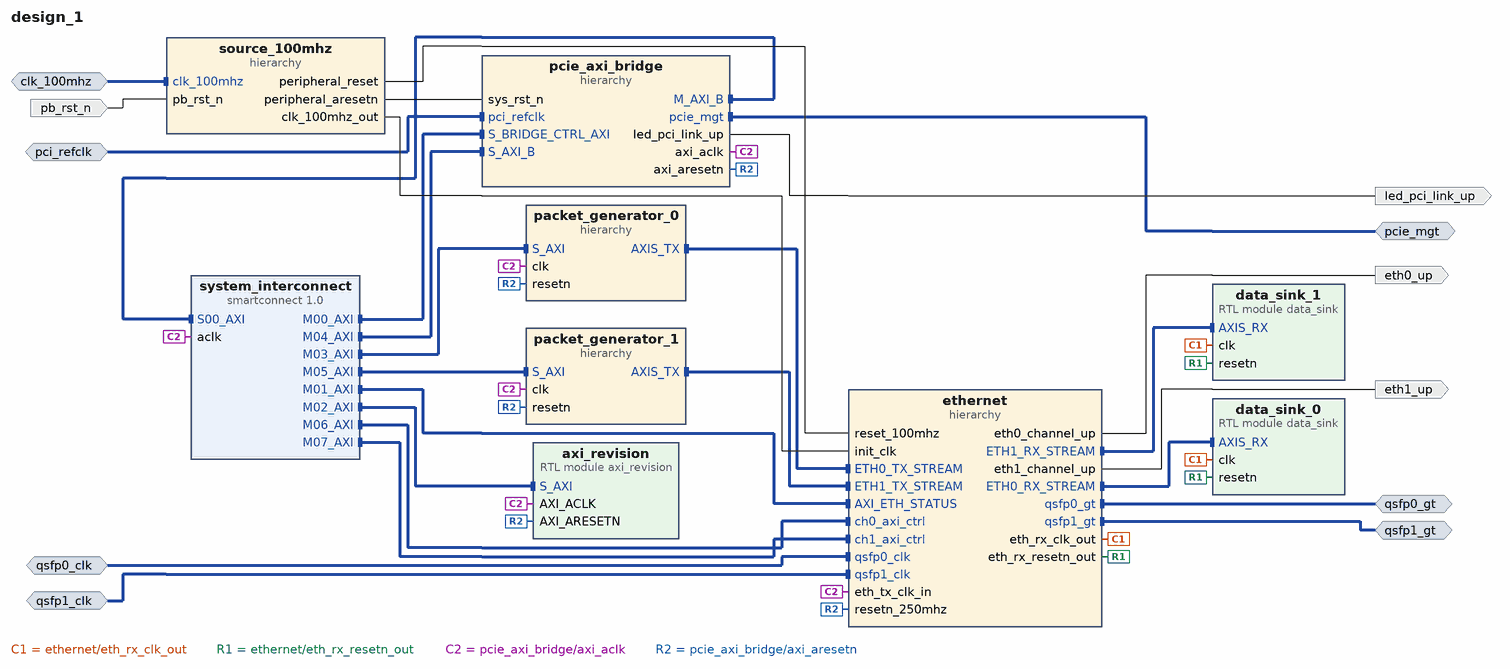
[diagram p0: block diagram of the top level]
# Vivado block design design_1, xczu19eg-ffvc1760-2-i, Vivado 2021.1
create_bd_design design_1

create_bd_intf_port -mode Slave -vlnv xilinx.com:interface:diff_clock_rtl:1.0 clk_100mhz
create_bd_intf_port -mode Slave -vlnv xilinx.com:interface:diff_clock_rtl:1.0 pci_refclk
create_bd_intf_port -mode Master -vlnv xilinx.com:interface:pcie_7x_mgt_rtl:1.0 pcie_mgt
create_bd_intf_port -mode Slave -vlnv xilinx.com:interface:diff_clock_rtl:1.0 qsfp0_clk
set_property -dict {CONFIG.FREQ_HZ 322265625} [get_bd_intf_ports qsfp0_clk]
create_bd_intf_port -mode Slave -vlnv xilinx.com:interface:diff_clock_rtl:1.0 qsfp1_clk
set_property -dict {CONFIG.FREQ_HZ 322265625} [get_bd_intf_ports qsfp1_clk]
create_bd_intf_port -mode Master -vlnv xilinx.com:interface:gt_rtl:1.0 qsfp0_gt
create_bd_intf_port -mode Master -vlnv xilinx.com:interface:gt_rtl:1.0 qsfp1_gt
create_bd_port -dir I -type rst pb_rst_n
create_bd_port -dir O led_pci_link_up
create_bd_port -dir O eth0_up
create_bd_port -dir O eth1_up

create_bd_cell -type hier pcie_axi_bridge
create_bd_cell -type hier ethernet
create_bd_cell -type ip -vlnv xilinx.com:ip:smartconnect:1.0 system_interconnect
set_property -dict [list \
  CONFIG.ADVANCED_PROPERTIES { __view__ { functional { S01_Entry { LIM_R_LEN 64 LIM_W_LEN 64 } S02_Entry { LIM_R_LEN 64 LIM_W_LEN 64 } } }} \
  CONFIG.HAS_ARESETN 0 \
  CONFIG.NUM_CLKS 1 \
  CONFIG.NUM_MI 8 \
  CONFIG.NUM_SI 3 \
] [get_bd_cells system_interconnect]
create_bd_cell -type hier source_100mhz
create_bd_cell -type module -reference axi_revision axi_revision
create_bd_cell -type module -reference data_sink data_sink_0
create_bd_cell -type module -reference data_sink data_sink_1
create_bd_cell -type hier packet_generator_0
create_bd_cell -type hier packet_generator_1

# ---- hierarchy /pcie_axi_bridge ----
current_bd_instance /pcie_axi_bridge
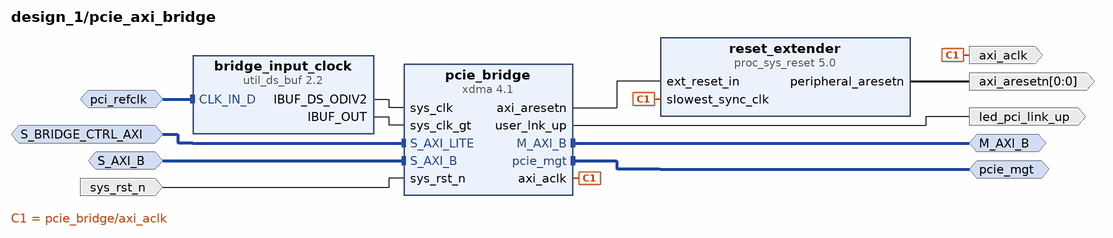
[diagram p1: block diagram inside /pcie_axi_bridge]
create_bd_intf_pin -mode Slave -vlnv xilinx.com:interface:aximm_rtl:1.0 S_BRIDGE_CTRL_AXI
create_bd_intf_pin -mode Slave -vlnv xilinx.com:interface:aximm_rtl:1.0 S_AXI_B
create_bd_intf_pin -mode Master -vlnv xilinx.com:interface:pcie_7x_mgt_rtl:1.0 pcie_mgt
create_bd_intf_pin -mode Master -vlnv xilinx.com:interface:aximm_rtl:1.0 M_AXI_B
create_bd_intf_pin -mode Slave -vlnv xilinx.com:interface:diff_clock_rtl:1.0 pci_refclk
create_bd_pin -dir O -from 0 -to 0 -type rst axi_aresetn
create_bd_pin -dir O -type clk axi_aclk
create_bd_pin -dir O led_pci_link_up
create_bd_pin -dir I -type rst sys_rst_n

create_bd_cell -type ip -vlnv xilinx.com:ip:xdma:4.1 pcie_bridge
set_property -dict [list \
  CONFIG.PF0_DEVICE_ID_mqdma 903F \
  CONFIG.PF0_SRIOV_VF_DEVICE_ID A03F \
  CONFIG.PF2_DEVICE_ID_mqdma 923F \
  CONFIG.PF3_DEVICE_ID_mqdma 933F \
  CONFIG.axi_addr_width 64 \
  CONFIG.axi_data_width 512_bit \
  CONFIG.axibar2pciebar_0 0x0 \
  CONFIG.axibar_num 1 \
  CONFIG.axilite_master_en true \
  CONFIG.axilite_master_size 8 \
  CONFIG.axisten_freq 250 \
  CONFIG.bridge_burst true \
  CONFIG.c_s_axi_supports_narrow_burst false \
  CONFIG.cfg_mgmt_if false \
  CONFIG.enable_jtag_dbg true \
  CONFIG.functional_mode AXI_Bridge \
  CONFIG.mode_selection Advanced \
  CONFIG.pcie_blk_locn X1Y0 \
  CONFIG.pcie_extended_tag false \
  CONFIG.pciebar2axibar_0 0x00000000 \
  CONFIG.pciebar2axibar_1 0x800000000 \
  CONFIG.pciebar2axibar_axil_master 0A0000000 \
  CONFIG.pf0_Use_Class_Code_Lookup_Assistant false \
  CONFIG.pf0_bar0_64bit false \
  CONFIG.pf0_bar0_scale Megabytes \
  CONFIG.pf0_bar0_size 1 \
  CONFIG.pf0_bar1_enabled true \
  CONFIG.pf0_bar1_scale Megabytes \
  CONFIG.pf0_bar1_size 1 \
  CONFIG.pf0_bar2_enabled false \
  CONFIG.pf0_base_class_menu Simple_communication_controllers \
  CONFIG.pf0_class_code_base 07 \
  CONFIG.pf0_class_code_interface 01 \
  CONFIG.pf0_class_code_sub 00 \
  CONFIG.pf0_device_id 903F \
  CONFIG.pf0_interrupt_pin INTA \
  CONFIG.pf0_msi_enabled false \
  CONFIG.pf0_sub_class_interface_menu 16450_compatible_serial_controller \
  CONFIG.pf0_subsystem_id 0007 \
  CONFIG.pl_link_cap_max_link_speed 8.0_GT/s \
  CONFIG.pl_link_cap_max_link_width X16 \
  CONFIG.plltype QPLL1 \
  CONFIG.xdma_num_usr_irq 1 \
  CONFIG.xdma_sts_ports false \
  CONFIG.xdma_wnum_rids 32 \
] [get_bd_cells pcie_bridge]
create_bd_cell -type ip -vlnv xilinx.com:ip:util_ds_buf:2.2 bridge_input_clock
set_property -dict {CONFIG.C_BUF_TYPE IBUFDSGTE} [get_bd_cells bridge_input_clock]
create_bd_cell -type ip -vlnv xilinx.com:ip:proc_sys_reset:5.0 reset_extender

# ---- hierarchy /ethernet ----
current_bd_instance /ethernet
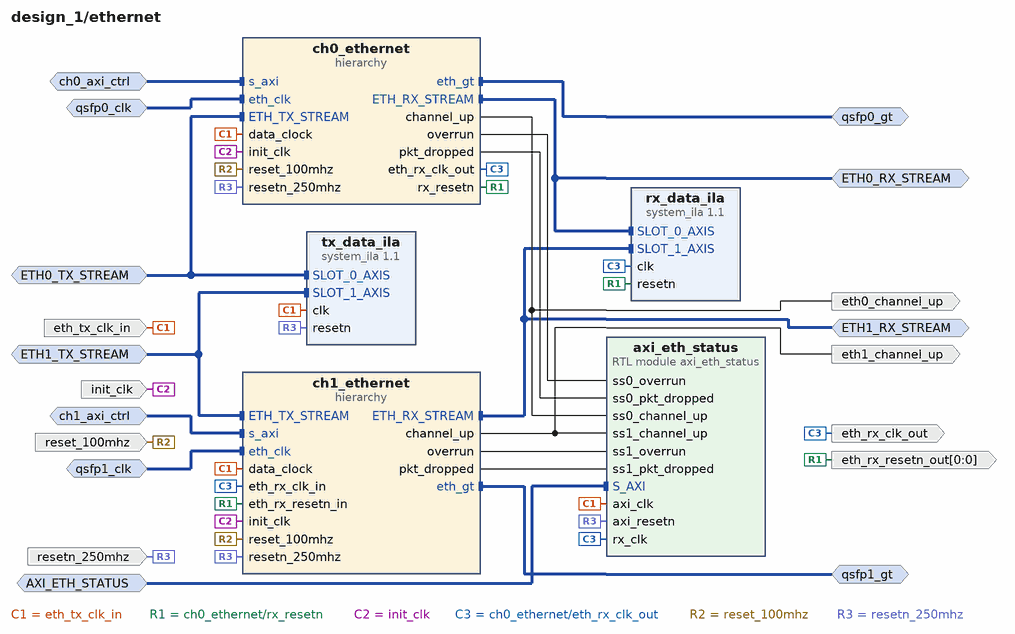
[diagram p2: block diagram inside /ethernet]
create_bd_intf_pin -mode Slave -vlnv xilinx.com:interface:diff_clock_rtl:1.0 qsfp0_clk
create_bd_intf_pin -mode Slave -vlnv xilinx.com:interface:diff_clock_rtl:1.0 qsfp1_clk
create_bd_intf_pin -mode Slave -vlnv xilinx.com:interface:axis_rtl:1.0 ETH0_TX_STREAM
create_bd_intf_pin -mode Slave -vlnv xilinx.com:interface:aximm_rtl:1.0 AXI_ETH_STATUS
create_bd_intf_pin -mode Master -vlnv xilinx.com:interface:gt_rtl:1.0 qsfp0_gt
create_bd_intf_pin -mode Master -vlnv xilinx.com:interface:gt_rtl:1.0 qsfp1_gt
create_bd_intf_pin -mode Slave -vlnv xilinx.com:interface:axis_rtl:1.0 ETH1_TX_STREAM
create_bd_intf_pin -mode Master -vlnv xilinx.com:interface:axis_rtl:1.0 ETH1_RX_STREAM
create_bd_intf_pin -mode Master -vlnv xilinx.com:interface:axis_rtl:1.0 ETH0_RX_STREAM
create_bd_intf_pin -mode Slave -vlnv xilinx.com:interface:aximm_rtl:1.0 ch0_axi_ctrl
create_bd_intf_pin -mode Slave -vlnv xilinx.com:interface:aximm_rtl:1.0 ch1_axi_ctrl
create_bd_pin -dir I -type clk init_clk
create_bd_pin -dir I -type rst reset_100mhz
create_bd_pin -dir O eth0_channel_up
create_bd_pin -dir O eth1_channel_up
create_bd_pin -dir I -type clk eth_tx_clk_in
create_bd_pin -dir O -type clk eth_rx_clk_out
create_bd_pin -dir O -from 0 -to 0 eth_rx_resetn_out
create_bd_pin -dir I -type rst resetn_250mhz

create_bd_cell -type hier ch0_ethernet
create_bd_cell -type hier ch1_ethernet
create_bd_cell -type ip -vlnv xilinx.com:ip:system_ila:1.1 tx_data_ila
set_property -dict [list \
  CONFIG.C_DATA_DEPTH 2048 \
  CONFIG.C_MON_TYPE INTERFACE \
  CONFIG.C_NUM_MONITOR_SLOTS 2 \
  CONFIG.C_NUM_OF_PROBES 1 \
  CONFIG.C_PROBE0_TYPE 0 \
  CONFIG.C_PROBE1_TYPE 0 \
  CONFIG.C_SLOT 1 \
  CONFIG.C_SLOT_0_INTF_TYPE xilinx.com:interface:axis_rtl:1.0 \
  CONFIG.C_SLOT_1_INTF_TYPE xilinx.com:interface:axis_rtl:1.0 \
] [get_bd_cells tx_data_ila]
create_bd_cell -type ip -vlnv xilinx.com:ip:system_ila:1.1 rx_data_ila
set_property -dict [list \
  CONFIG.C_NUM_MONITOR_SLOTS 2 \
  CONFIG.C_SLOT 1 \
  CONFIG.C_SLOT_0_INTF_TYPE xilinx.com:interface:axis_rtl:1.0 \
  CONFIG.C_SLOT_1_INTF_TYPE xilinx.com:interface:axis_rtl:1.0 \
] [get_bd_cells rx_data_ila]
create_bd_cell -type module -reference axi_eth_status axi_eth_status

# ---- hierarchy /ethernet/ch0_ethernet ----
current_bd_instance /ethernet/ch0_ethernet
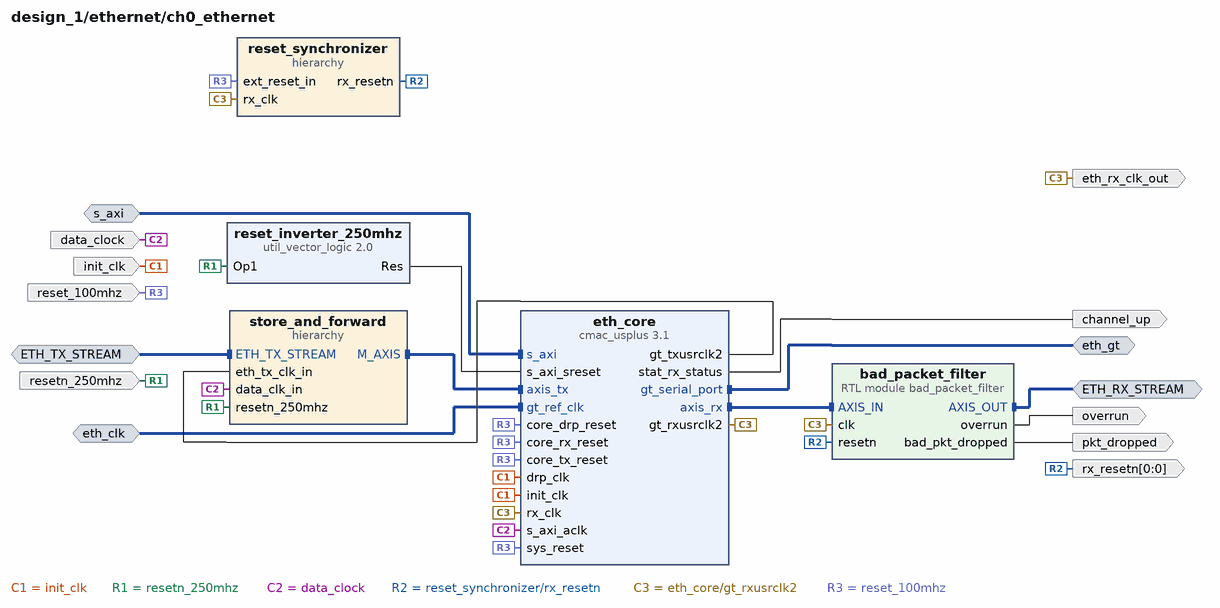
[diagram p3: block diagram inside /ethernet/ch0_ethernet]
create_bd_intf_pin -mode Master -vlnv xilinx.com:interface:gt_rtl:1.0 eth_gt
create_bd_intf_pin -mode Slave -vlnv xilinx.com:interface:diff_clock_rtl:1.0 eth_clk
create_bd_intf_pin -mode Slave -vlnv xilinx.com:interface:axis_rtl:1.0 ETH_TX_STREAM
create_bd_intf_pin -mode Master -vlnv xilinx.com:interface:axis_rtl:1.0 ETH_RX_STREAM
create_bd_intf_pin -mode Slave -vlnv xilinx.com:interface:aximm_rtl:1.0 s_axi
create_bd_pin -dir I -type rst reset_100mhz
create_bd_pin -dir I -type clk init_clk
create_bd_pin -dir O -type clk eth_rx_clk_out
create_bd_pin -dir O channel_up
create_bd_pin -dir I -type rst resetn_250mhz
create_bd_pin -dir I -type clk data_clock
create_bd_pin -dir O -from 0 -to 0 rx_resetn
create_bd_pin -dir O overrun
create_bd_pin -dir O pkt_dropped

create_bd_cell -type ip -vlnv xilinx.com:ip:cmac_usplus:3.1 eth_core
set_property -dict [list \
  CONFIG.CMAC_CAUI4_MODE 1 \
  CONFIG.CMAC_CORE_SELECT CMACE4_X0Y1 \
  CONFIG.ENABLE_AXI_INTERFACE 1 \
  CONFIG.GT_GROUP_SELECT {X0Y12~X0Y15} \
  CONFIG.GT_REF_CLK_FREQ 322.265625 \
  CONFIG.INCLUDE_RS_FEC 1 \
  CONFIG.INCLUDE_STATISTICS_COUNTERS 1 \
  CONFIG.INS_LOSS_NYQ 12 \
  CONFIG.NUM_LANES 4x25 \
  CONFIG.RX_FLOW_CONTROL 0 \
  CONFIG.TX_FLOW_CONTROL 0 \
  CONFIG.USER_INTERFACE AXIS \
] [get_bd_cells eth_core]
create_bd_cell -type ip -vlnv xilinx.com:ip:util_vector_logic:2.0 reset_inverter_250mhz
set_property -dict {CONFIG.C_OPERATION not CONFIG.C_SIZE 1} [get_bd_cells reset_inverter_250mhz]
create_bd_cell -type hier reset_synchronizer
create_bd_cell -type hier store_and_forward
create_bd_cell -type module -reference bad_packet_filter bad_packet_filter

# ---- hierarchy /ethernet/ch0_ethernet/reset_synchronizer ----
current_bd_instance /ethernet/ch0_ethernet/reset_synchronizer
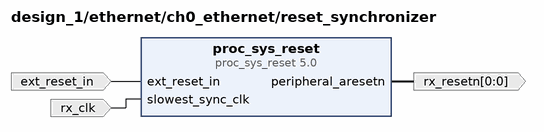
[diagram p4: block diagram inside /ethernet/ch0_ethernet/reset_synchronizer]
create_bd_pin -dir I -type clk rx_clk
create_bd_pin -dir I -type rst ext_reset_in
create_bd_pin -dir O -from 0 -to 0 -type rst rx_resetn

create_bd_cell -type ip -vlnv xilinx.com:ip:proc_sys_reset:5.0 proc_sys_reset

# ---- hierarchy /ethernet/ch0_ethernet/store_and_forward ----
current_bd_instance /ethernet/ch0_ethernet/store_and_forward
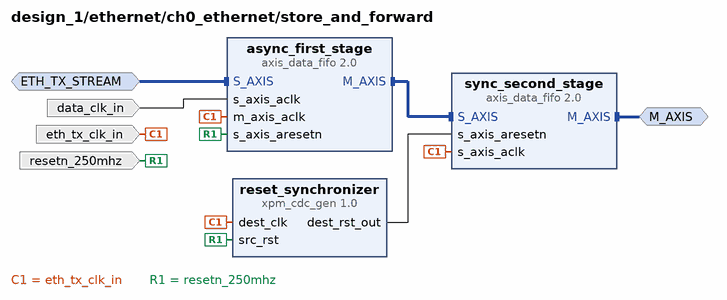
[diagram p5: block diagram inside /ethernet/ch0_ethernet/store_and_forward]
create_bd_intf_pin -mode Slave -vlnv xilinx.com:interface:axis_rtl:1.0 ETH_TX_STREAM
create_bd_intf_pin -mode Master -vlnv xilinx.com:interface:axis_rtl:1.0 M_AXIS
create_bd_pin -dir I -type clk eth_tx_clk_in
create_bd_pin -dir I -type rst resetn_250mhz
create_bd_pin -dir I -type clk data_clk_in

create_bd_cell -type ip -vlnv xilinx.com:ip:axis_data_fifo:2.0 async_first_stage
set_property -dict {CONFIG.FIFO_DEPTH 256 CONFIG.FIFO_MODE 1 CONFIG.IS_ACLK_ASYNC 1} [get_bd_cells async_first_stage]
create_bd_cell -type ip -vlnv xilinx.com:ip:axis_data_fifo:2.0 sync_second_stage
set_property -dict {CONFIG.FIFO_DEPTH 256 CONFIG.FIFO_MODE 2 CONFIG.IS_ACLK_ASYNC 0} [get_bd_cells sync_second_stage]
create_bd_cell -type ip -vlnv xilinx.com:ip:xpm_cdc_gen:1.0 reset_synchronizer
set_property -dict [list \
  CONFIG.CDC_TYPE xpm_cdc_sync_rst \
  CONFIG.INIT false \
  CONFIG.SIM_ASSERT_CHK false \
] [get_bd_cells reset_synchronizer]

# ---- hierarchy /ethernet/ch1_ethernet ----
current_bd_instance /ethernet/ch1_ethernet
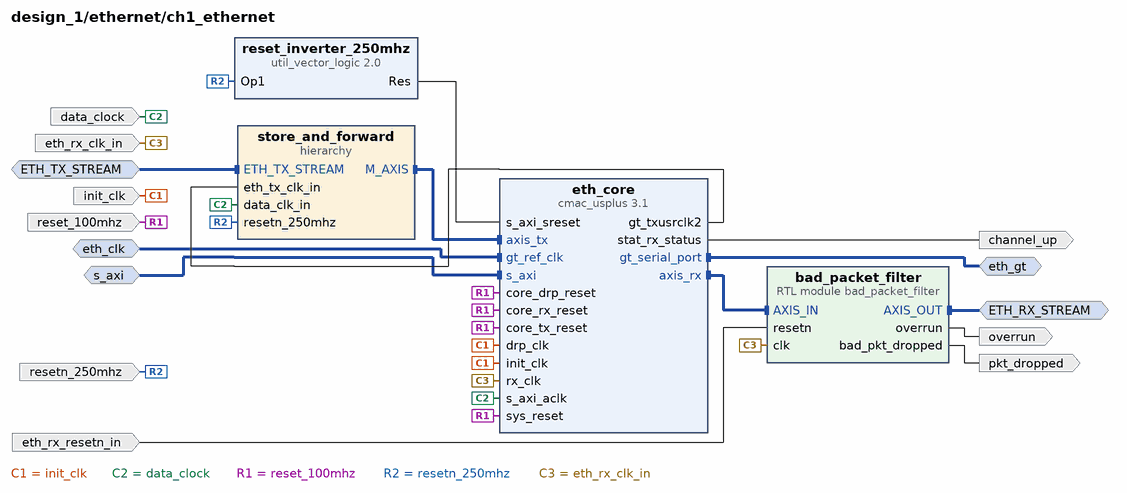
[diagram p6: block diagram inside /ethernet/ch1_ethernet]
create_bd_intf_pin -mode Master -vlnv xilinx.com:interface:gt_rtl:1.0 eth_gt
create_bd_intf_pin -mode Slave -vlnv xilinx.com:interface:diff_clock_rtl:1.0 eth_clk
create_bd_intf_pin -mode Slave -vlnv xilinx.com:interface:axis_rtl:1.0 ETH_TX_STREAM
create_bd_intf_pin -mode Master -vlnv xilinx.com:interface:axis_rtl:1.0 ETH_RX_STREAM
create_bd_intf_pin -mode Slave -vlnv xilinx.com:interface:aximm_rtl:1.0 s_axi
create_bd_pin -dir I -type rst reset_100mhz
create_bd_pin -dir I -type clk init_clk
create_bd_pin -dir O channel_up
create_bd_pin -dir I -type clk data_clock
create_bd_pin -dir I -type clk eth_rx_clk_in
create_bd_pin -dir O overrun
create_bd_pin -dir I -type rst resetn_250mhz
create_bd_pin -dir O pkt_dropped
create_bd_pin -dir I -type rst eth_rx_resetn_in

create_bd_cell -type ip -vlnv xilinx.com:ip:cmac_usplus:3.1 eth_core
set_property -dict [list \
  CONFIG.CMAC_CAUI4_MODE 1 \
  CONFIG.CMAC_CORE_SELECT CMACE4_X0Y2 \
  CONFIG.ENABLE_AXI_INTERFACE 1 \
  CONFIG.GT_GROUP_SELECT {X0Y16~X0Y19} \
  CONFIG.GT_REF_CLK_FREQ 322.265625 \
  CONFIG.INCLUDE_RS_FEC 1 \
  CONFIG.INCLUDE_STATISTICS_COUNTERS 1 \
  CONFIG.INS_LOSS_NYQ 12 \
  CONFIG.NUM_LANES 4x25 \
  CONFIG.RX_FLOW_CONTROL 0 \
  CONFIG.TX_FLOW_CONTROL 0 \
  CONFIG.USER_INTERFACE AXIS \
] [get_bd_cells eth_core]
create_bd_cell -type ip -vlnv xilinx.com:ip:util_vector_logic:2.0 reset_inverter_250mhz
set_property -dict {CONFIG.C_OPERATION not CONFIG.C_SIZE 1} [get_bd_cells reset_inverter_250mhz]
create_bd_cell -type module -reference bad_packet_filter bad_packet_filter
create_bd_cell -type hier store_and_forward

# ---- hierarchy /ethernet/ch1_ethernet/store_and_forward ----
current_bd_instance /ethernet/ch1_ethernet/store_and_forward
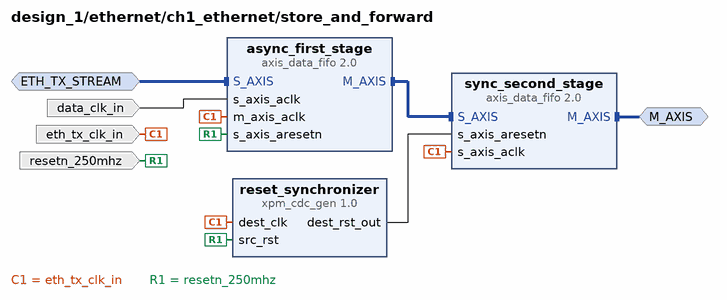
[diagram p7: block diagram inside /ethernet/ch1_ethernet/store_and_forward]
create_bd_intf_pin -mode Slave -vlnv xilinx.com:interface:axis_rtl:1.0 ETH_TX_STREAM
create_bd_intf_pin -mode Master -vlnv xilinx.com:interface:axis_rtl:1.0 M_AXIS
create_bd_pin -dir I -type clk eth_tx_clk_in
create_bd_pin -dir I -type rst resetn_250mhz
create_bd_pin -dir I -type clk data_clk_in

create_bd_cell -type ip -vlnv xilinx.com:ip:axis_data_fifo:2.0 async_first_stage
set_property -dict {CONFIG.FIFO_DEPTH 256 CONFIG.FIFO_MODE 1 CONFIG.IS_ACLK_ASYNC 1} [get_bd_cells async_first_stage]
create_bd_cell -type ip -vlnv xilinx.com:ip:axis_data_fifo:2.0 sync_second_stage
set_property -dict {CONFIG.FIFO_DEPTH 256 CONFIG.FIFO_MODE 2 CONFIG.IS_ACLK_ASYNC 0} [get_bd_cells sync_second_stage]
create_bd_cell -type ip -vlnv xilinx.com:ip:xpm_cdc_gen:1.0 reset_synchronizer
set_property -dict [list \
  CONFIG.CDC_TYPE xpm_cdc_sync_rst \
  CONFIG.INIT false \
  CONFIG.SIM_ASSERT_CHK false \
] [get_bd_cells reset_synchronizer]

# ---- hierarchy /source_100mhz ----
current_bd_instance /source_100mhz
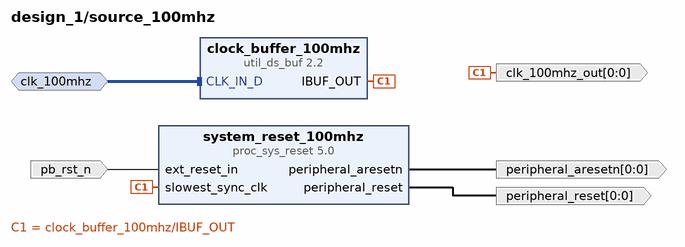
[diagram p8: block diagram inside /source_100mhz]
create_bd_intf_pin -mode Slave -vlnv xilinx.com:interface:diff_clock_rtl:1.0 clk_100mhz
create_bd_pin -dir O -from 0 -to 0 -type rst peripheral_aresetn
create_bd_pin -dir I -type rst pb_rst_n
create_bd_pin -dir O -from 0 -to 0 -type rst peripheral_reset
create_bd_pin -dir O -from 0 -to 0 -type clk clk_100mhz_out

create_bd_cell -type ip -vlnv xilinx.com:ip:proc_sys_reset:5.0 system_reset_100mhz
create_bd_cell -type ip -vlnv xilinx.com:ip:util_ds_buf:2.2 clock_buffer_100mhz

# ---- hierarchy /packet_generator_0 ----
current_bd_instance /packet_generator_0
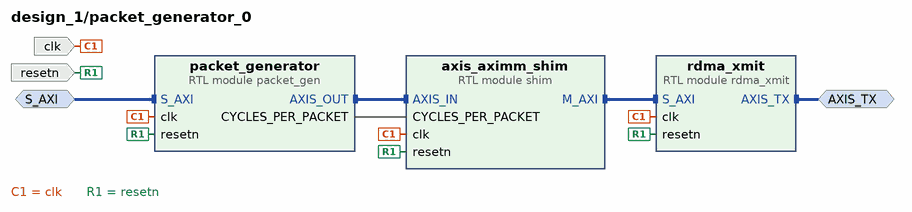
[diagram p9: block diagram inside /packet_generator_0]
create_bd_intf_pin -mode Slave -vlnv xilinx.com:interface:aximm_rtl:1.0 S_AXI
create_bd_intf_pin -mode Master -vlnv xilinx.com:interface:axis_rtl:1.0 AXIS_TX
create_bd_pin -dir I -type rst resetn
create_bd_pin -dir I -type clk clk

create_bd_cell -type module -reference shim axis_aximm_shim
create_bd_cell -type module -reference rdma_xmit rdma_xmit
create_bd_cell -type module -reference packet_gen packet_generator

# ---- hierarchy /packet_generator_1 ----
current_bd_instance /packet_generator_1
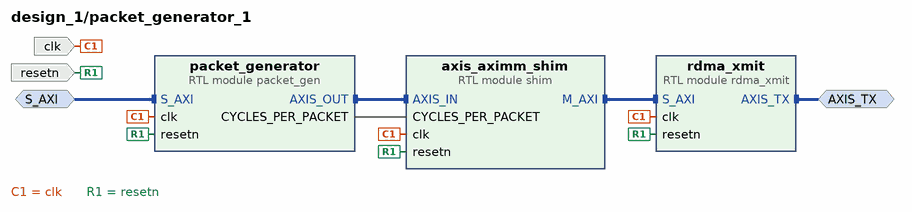
[diagram p10: block diagram inside /packet_generator_1]
create_bd_intf_pin -mode Slave -vlnv xilinx.com:interface:aximm_rtl:1.0 S_AXI
create_bd_intf_pin -mode Master -vlnv xilinx.com:interface:axis_rtl:1.0 AXIS_TX
create_bd_pin -dir I -type rst resetn
create_bd_pin -dir I -type clk clk

create_bd_cell -type module -reference shim axis_aximm_shim
create_bd_cell -type module -reference rdma_xmit rdma_xmit
create_bd_cell -type module -reference packet_gen packet_generator

# ---- connections ----

current_bd_instance /pcie_axi_bridge
connect_bd_intf_net [get_bd_intf_pins S_BRIDGE_CTRL_AXI] [get_bd_intf_pins pcie_bridge/S_AXI_LITE]
connect_bd_intf_net [get_bd_intf_pins pcie_mgt] [get_bd_intf_pins pcie_bridge/pcie_mgt]
connect_bd_intf_net [get_bd_intf_pins M_AXI_B] [get_bd_intf_pins pcie_bridge/M_AXI_B]
connect_bd_intf_net [get_bd_intf_pins pci_refclk] [get_bd_intf_pins bridge_input_clock/CLK_IN_D]
connect_bd_intf_net [get_bd_intf_pins S_AXI_B] [get_bd_intf_pins pcie_bridge/S_AXI_B]
connect_bd_net [get_bd_pins bridge_input_clock/IBUF_DS_ODIV2] [get_bd_pins pcie_bridge/sys_clk]
connect_bd_net [get_bd_pins bridge_input_clock/IBUF_OUT] [get_bd_pins pcie_bridge/sys_clk_gt]
connect_bd_net [get_bd_pins pcie_bridge/axi_aclk] [get_bd_pins axi_aclk] [get_bd_pins reset_extender/slowest_sync_clk]
connect_bd_net [get_bd_pins pcie_bridge/axi_aresetn] [get_bd_pins reset_extender/ext_reset_in]
connect_bd_net [get_bd_pins pcie_bridge/user_lnk_up] [get_bd_pins led_pci_link_up]
connect_bd_net -net proc_sys_reset_0_peripheral_aresetn [get_bd_pins reset_extender/peripheral_aresetn] [get_bd_pins axi_aresetn]
connect_bd_net [get_bd_pins sys_rst_n] [get_bd_pins pcie_bridge/sys_rst_n]

current_bd_instance /ethernet
connect_bd_intf_net [get_bd_intf_pins AXI_ETH_STATUS] [get_bd_intf_pins axi_eth_status/S_AXI]
connect_bd_intf_net [get_bd_intf_pins ch0_axi_ctrl] [get_bd_intf_pins ch0_ethernet/s_axi]
connect_bd_intf_net [get_bd_intf_pins ch1_axi_ctrl] [get_bd_intf_pins ch1_ethernet/s_axi]
connect_bd_intf_net [get_bd_intf_pins qsfp1_gt] [get_bd_intf_pins ch1_ethernet/eth_gt]
connect_bd_intf_net [get_bd_intf_pins qsfp0_gt] [get_bd_intf_pins ch0_ethernet/eth_gt]
connect_bd_intf_net [get_bd_intf_pins ETH0_RX_STREAM] [get_bd_intf_pins ch0_ethernet/ETH_RX_STREAM]
connect_bd_intf_net [get_bd_intf_pins ETH0_RX_STREAM] [get_bd_intf_pins rx_data_ila/SLOT_0_AXIS]
connect_bd_intf_net [get_bd_intf_pins ETH0_TX_STREAM] [get_bd_intf_pins ch0_ethernet/ETH_TX_STREAM]
connect_bd_intf_net [get_bd_intf_pins ETH0_TX_STREAM] [get_bd_intf_pins tx_data_ila/SLOT_0_AXIS]
connect_bd_intf_net [get_bd_intf_pins ETH1_RX_STREAM] [get_bd_intf_pins ch1_ethernet/ETH_RX_STREAM]
connect_bd_intf_net [get_bd_intf_pins ETH1_RX_STREAM] [get_bd_intf_pins rx_data_ila/SLOT_1_AXIS]
connect_bd_intf_net [get_bd_intf_pins ETH1_TX_STREAM] [get_bd_intf_pins ch1_ethernet/ETH_TX_STREAM]
connect_bd_intf_net [get_bd_intf_pins ETH1_TX_STREAM] [get_bd_intf_pins tx_data_ila/SLOT_1_AXIS]
connect_bd_intf_net [get_bd_intf_pins qsfp0_clk] [get_bd_intf_pins ch0_ethernet/eth_clk]
connect_bd_intf_net [get_bd_intf_pins qsfp1_clk] [get_bd_intf_pins ch1_ethernet/eth_clk]
connect_bd_net -net aclk_1 [get_bd_pins eth_tx_clk_in] \
  [get_bd_pins ch1_ethernet/data_clock] [get_bd_pins ch0_ethernet/data_clock] [get_bd_pins tx_data_ila/clk] \
  [get_bd_pins axi_eth_status/axi_clk]
connect_bd_net [get_bd_pins ch0_ethernet/rx_resetn] \
  [get_bd_pins rx_data_ila/resetn] [get_bd_pins eth_rx_resetn_out] [get_bd_pins ch1_ethernet/eth_rx_resetn_in]
connect_bd_net -net clock_1 [get_bd_pins init_clk] [get_bd_pins ch0_ethernet/init_clk] [get_bd_pins ch1_ethernet/init_clk]
connect_bd_net -net eth0_channel_up [get_bd_pins ch0_ethernet/channel_up] [get_bd_pins eth0_channel_up] [get_bd_pins axi_eth_status/ss0_channel_up]
connect_bd_net -net eth0_overrun [get_bd_pins ch0_ethernet/overrun] [get_bd_pins axi_eth_status/ss0_overrun]
connect_bd_net -net eth0_pkt_dropped [get_bd_pins ch0_ethernet/pkt_dropped] [get_bd_pins axi_eth_status/ss0_pkt_dropped]
connect_bd_net -net eth1_channel_up [get_bd_pins ch1_ethernet/channel_up] [get_bd_pins eth1_channel_up] [get_bd_pins axi_eth_status/ss1_channel_up]
connect_bd_net -net eth1_overrun [get_bd_pins ch1_ethernet/overrun] [get_bd_pins axi_eth_status/ss1_overrun]
connect_bd_net -net eth1_pkt_dropped [get_bd_pins ch1_ethernet/pkt_dropped] [get_bd_pins axi_eth_status/ss1_pkt_dropped]
connect_bd_net -net qsfp0_ethernet_gt_rxusrclk2 [get_bd_pins ch0_ethernet/eth_rx_clk_out] \
  [get_bd_pins ch1_ethernet/eth_rx_clk_in] [get_bd_pins eth_rx_clk_out] [get_bd_pins rx_data_ila/clk] \
  [get_bd_pins axi_eth_status/rx_clk]
connect_bd_net -net reset_in_1 [get_bd_pins reset_100mhz] [get_bd_pins ch0_ethernet/reset_100mhz] [get_bd_pins ch1_ethernet/reset_100mhz]
connect_bd_net [get_bd_pins resetn_250mhz] \
  [get_bd_pins ch0_ethernet/resetn_250mhz] [get_bd_pins tx_data_ila/resetn] [get_bd_pins ch1_ethernet/resetn_250mhz] \
  [get_bd_pins axi_eth_status/axi_resetn]

current_bd_instance /ethernet/ch0_ethernet
connect_bd_intf_net [get_bd_intf_pins s_axi] [get_bd_intf_pins eth_core/s_axi]
connect_bd_intf_net [get_bd_intf_pins eth_gt] [get_bd_intf_pins eth_core/gt_serial_port]
connect_bd_intf_net [get_bd_intf_pins ETH_TX_STREAM] [get_bd_intf_pins store_and_forward/ETH_TX_STREAM]
connect_bd_intf_net [get_bd_intf_pins ETH_RX_STREAM] [get_bd_intf_pins bad_packet_filter/AXIS_OUT]
connect_bd_intf_net [get_bd_intf_pins eth_core/axis_rx] [get_bd_intf_pins bad_packet_filter/AXIS_IN]
connect_bd_intf_net [get_bd_intf_pins eth_clk] [get_bd_intf_pins eth_core/gt_ref_clk]
connect_bd_intf_net [get_bd_intf_pins eth_core/axis_tx] [get_bd_intf_pins store_and_forward/M_AXIS]
connect_bd_net -net aurora_64b66b_0_channel_up [get_bd_pins eth_core/stat_rx_status] [get_bd_pins channel_up]
connect_bd_net -net bad_packet_filter_0_bad_pkt_dropped [get_bd_pins bad_packet_filter/bad_pkt_dropped] [get_bd_pins pkt_dropped]
connect_bd_net -net bad_packet_filter_0_overrun [get_bd_pins bad_packet_filter/overrun] [get_bd_pins overrun]
connect_bd_net -net clock_1 [get_bd_pins init_clk] [get_bd_pins eth_core/drp_clk] [get_bd_pins eth_core/init_clk]
connect_bd_net -net data_aresetn_1 [get_bd_pins resetn_250mhz] [get_bd_pins reset_inverter_250mhz/Op1] [get_bd_pins store_and_forward/resetn_250mhz]
connect_bd_net [get_bd_pins data_clock] [get_bd_pins eth_core/s_axi_aclk] [get_bd_pins store_and_forward/data_clk_in]
connect_bd_net -net ethernet_gt_txusrclk2 [get_bd_pins eth_core/gt_txusrclk2] [get_bd_pins store_and_forward/eth_tx_clk_in]
connect_bd_net -net proc_sys_reset_0_interconnect_aresetn [get_bd_pins reset_synchronizer/rx_resetn] \
  [get_bd_pins rx_resetn] [get_bd_pins bad_packet_filter/resetn]
connect_bd_net -net qsfp0_ethernet_gt_rxusrclk2 [get_bd_pins eth_core/gt_rxusrclk2] \
  [get_bd_pins eth_rx_clk_out] [get_bd_pins eth_core/rx_clk] [get_bd_pins reset_synchronizer/rx_clk] \
  [get_bd_pins bad_packet_filter/clk]
connect_bd_net -net reset_in_1 [get_bd_pins reset_100mhz] \
  [get_bd_pins eth_core/core_tx_reset] [get_bd_pins eth_core/core_rx_reset] [get_bd_pins eth_core/core_drp_reset] \
  [get_bd_pins eth_core/sys_reset] [get_bd_pins reset_synchronizer/ext_reset_in]
connect_bd_net [get_bd_pins reset_inverter_250mhz/Res] [get_bd_pins eth_core/s_axi_sreset]

current_bd_instance /ethernet/ch0_ethernet/reset_synchronizer
connect_bd_net -net ethernet_usr_rx_reset [get_bd_pins ext_reset_in] [get_bd_pins proc_sys_reset/ext_reset_in]
connect_bd_net [get_bd_pins proc_sys_reset/peripheral_aresetn] [get_bd_pins rx_resetn]
connect_bd_net -net qsfp0_ethernet_gt_rxusrclk2 [get_bd_pins rx_clk] [get_bd_pins proc_sys_reset/slowest_sync_clk]

current_bd_instance /ethernet/ch0_ethernet/store_and_forward
connect_bd_intf_net [get_bd_intf_pins ETH_TX_STREAM] [get_bd_intf_pins async_first_stage/S_AXIS]
connect_bd_intf_net [get_bd_intf_pins async_first_stage/M_AXIS] [get_bd_intf_pins sync_second_stage/S_AXIS]
connect_bd_intf_net [get_bd_intf_pins M_AXIS] [get_bd_intf_pins sync_second_stage/M_AXIS]
connect_bd_net -net eth_tx_clk_in_1 [get_bd_pins data_clk_in] [get_bd_pins async_first_stage/s_axis_aclk]
connect_bd_net -net m_axis_aclk_1 [get_bd_pins eth_tx_clk_in] \
  [get_bd_pins async_first_stage/m_axis_aclk] [get_bd_pins reset_synchronizer/dest_clk] \
  [get_bd_pins sync_second_stage/s_axis_aclk]
connect_bd_net [get_bd_pins reset_synchronizer/dest_rst_out] [get_bd_pins sync_second_stage/s_axis_aresetn]
connect_bd_net [get_bd_pins resetn_250mhz] [get_bd_pins async_first_stage/s_axis_aresetn] [get_bd_pins reset_synchronizer/src_rst]

current_bd_instance /ethernet/ch1_ethernet
connect_bd_intf_net [get_bd_intf_pins eth_gt] [get_bd_intf_pins eth_core/gt_serial_port]
connect_bd_intf_net [get_bd_intf_pins ETH_TX_STREAM] [get_bd_intf_pins store_and_forward/ETH_TX_STREAM]
connect_bd_intf_net [get_bd_intf_pins ETH_RX_STREAM] [get_bd_intf_pins bad_packet_filter/AXIS_OUT]
connect_bd_intf_net [get_bd_intf_pins bad_packet_filter/AXIS_IN] [get_bd_intf_pins eth_core/axis_rx]
connect_bd_intf_net [get_bd_intf_pins eth_clk] [get_bd_intf_pins eth_core/gt_ref_clk]
connect_bd_intf_net [get_bd_intf_pins s_axi] [get_bd_intf_pins eth_core/s_axi]
connect_bd_intf_net [get_bd_intf_pins store_and_forward/M_AXIS] [get_bd_intf_pins eth_core/axis_tx]
connect_bd_net -net aurora_core_1_channel_up [get_bd_pins eth_core/stat_rx_status] [get_bd_pins channel_up]
connect_bd_net -net bad_packet_filter_0_bad_pkt_dropped [get_bd_pins bad_packet_filter/bad_pkt_dropped] [get_bd_pins pkt_dropped]
connect_bd_net -net bad_packet_filter_0_overrun [get_bd_pins bad_packet_filter/overrun] [get_bd_pins overrun]
connect_bd_net -net clock_1 [get_bd_pins init_clk] [get_bd_pins eth_core/drp_clk] [get_bd_pins eth_core/init_clk]
connect_bd_net [get_bd_pins data_clock] [get_bd_pins eth_core/s_axi_aclk] [get_bd_pins store_and_forward/data_clk_in]
connect_bd_net [get_bd_pins eth_rx_resetn_in] [get_bd_pins bad_packet_filter/resetn]
connect_bd_net -net eth_tx_clk_in_1 [get_bd_pins eth_core/gt_txusrclk2] [get_bd_pins store_and_forward/eth_tx_clk_in]
connect_bd_net -net reset_in_1 [get_bd_pins reset_100mhz] \
  [get_bd_pins eth_core/core_rx_reset] [get_bd_pins eth_core/core_tx_reset] [get_bd_pins eth_core/core_drp_reset] \
  [get_bd_pins eth_core/sys_reset]
connect_bd_net [get_bd_pins reset_inverter_250mhz/Res] [get_bd_pins eth_core/s_axi_sreset]
connect_bd_net [get_bd_pins resetn_250mhz] [get_bd_pins reset_inverter_250mhz/Op1] [get_bd_pins store_and_forward/resetn_250mhz]
connect_bd_net -net rx_clk_0_1 [get_bd_pins eth_rx_clk_in] [get_bd_pins eth_core/rx_clk] [get_bd_pins bad_packet_filter/clk]

current_bd_instance /ethernet/ch1_ethernet/store_and_forward
connect_bd_intf_net [get_bd_intf_pins ETH_TX_STREAM] [get_bd_intf_pins async_first_stage/S_AXIS]
connect_bd_intf_net [get_bd_intf_pins async_first_stage/M_AXIS] [get_bd_intf_pins sync_second_stage/S_AXIS]
connect_bd_intf_net [get_bd_intf_pins M_AXIS] [get_bd_intf_pins sync_second_stage/M_AXIS]
connect_bd_net -net eth_tx_clk_in_1 [get_bd_pins data_clk_in] [get_bd_pins async_first_stage/s_axis_aclk]
connect_bd_net -net m_axis_aclk_1 [get_bd_pins eth_tx_clk_in] \
  [get_bd_pins async_first_stage/m_axis_aclk] [get_bd_pins reset_synchronizer/dest_clk] \
  [get_bd_pins sync_second_stage/s_axis_aclk]
connect_bd_net [get_bd_pins reset_synchronizer/dest_rst_out] [get_bd_pins sync_second_stage/s_axis_aresetn]
connect_bd_net [get_bd_pins resetn_250mhz] [get_bd_pins async_first_stage/s_axis_aresetn] [get_bd_pins reset_synchronizer/src_rst]

current_bd_instance /source_100mhz
connect_bd_intf_net [get_bd_intf_pins clk_100mhz] [get_bd_intf_pins clock_buffer_100mhz/CLK_IN_D]
connect_bd_net [get_bd_pins clock_buffer_100mhz/IBUF_OUT] [get_bd_pins system_reset_100mhz/slowest_sync_clk] [get_bd_pins clk_100mhz_out]
connect_bd_net [get_bd_pins pb_rst_n] [get_bd_pins system_reset_100mhz/ext_reset_in]
connect_bd_net [get_bd_pins system_reset_100mhz/peripheral_aresetn] [get_bd_pins peripheral_aresetn]
connect_bd_net [get_bd_pins system_reset_100mhz/peripheral_reset] [get_bd_pins peripheral_reset]

current_bd_instance /packet_generator_0
connect_bd_intf_net [get_bd_intf_pins S_AXI] [get_bd_intf_pins packet_generator/S_AXI]
connect_bd_intf_net [get_bd_intf_pins AXIS_TX] [get_bd_intf_pins rdma_xmit/AXIS_TX]
connect_bd_intf_net [get_bd_intf_pins axis_aximm_shim/M_AXI] [get_bd_intf_pins rdma_xmit/S_AXI]
connect_bd_intf_net [get_bd_intf_pins packet_generator/AXIS_OUT] [get_bd_intf_pins axis_aximm_shim/AXIS_IN]
connect_bd_net [get_bd_pins clk] [get_bd_pins axis_aximm_shim/clk] [get_bd_pins rdma_xmit/clk] [get_bd_pins packet_generator/clk]
connect_bd_net [get_bd_pins packet_generator/CYCLES_PER_PACKET] [get_bd_pins axis_aximm_shim/CYCLES_PER_PACKET]
connect_bd_net [get_bd_pins resetn] [get_bd_pins axis_aximm_shim/resetn] [get_bd_pins rdma_xmit/resetn] [get_bd_pins packet_generator/resetn]

current_bd_instance /packet_generator_1
connect_bd_intf_net [get_bd_intf_pins S_AXI] [get_bd_intf_pins packet_generator/S_AXI]
connect_bd_intf_net [get_bd_intf_pins AXIS_TX] [get_bd_intf_pins rdma_xmit/AXIS_TX]
connect_bd_intf_net [get_bd_intf_pins axis_aximm_shim/M_AXI] [get_bd_intf_pins rdma_xmit/S_AXI]
connect_bd_intf_net [get_bd_intf_pins packet_generator/AXIS_OUT] [get_bd_intf_pins axis_aximm_shim/AXIS_IN]
connect_bd_net [get_bd_pins clk] [get_bd_pins axis_aximm_shim/clk] [get_bd_pins rdma_xmit/clk] [get_bd_pins packet_generator/clk]
connect_bd_net [get_bd_pins packet_generator/CYCLES_PER_PACKET] [get_bd_pins axis_aximm_shim/CYCLES_PER_PACKET]
connect_bd_net [get_bd_pins resetn] [get_bd_pins axis_aximm_shim/resetn] [get_bd_pins rdma_xmit/resetn] [get_bd_pins packet_generator/resetn]

current_bd_instance /
connect_bd_intf_net [get_bd_intf_pins ethernet/ETH0_TX_STREAM] [get_bd_intf_pins packet_generator_0/AXIS_TX]
connect_bd_intf_net [get_bd_intf_ports qsfp0_clk] [get_bd_intf_pins ethernet/qsfp0_clk]
connect_bd_intf_net [get_bd_intf_ports qsfp1_clk] [get_bd_intf_pins ethernet/qsfp1_clk]
connect_bd_intf_net [get_bd_intf_ports clk_100mhz] [get_bd_intf_pins source_100mhz/clk_100mhz]
connect_bd_intf_net [get_bd_intf_pins data_sink_0/AXIS_RX] [get_bd_intf_pins ethernet/ETH0_RX_STREAM]
connect_bd_intf_net [get_bd_intf_pins data_sink_1/AXIS_RX] [get_bd_intf_pins ethernet/ETH1_RX_STREAM]
connect_bd_intf_net [get_bd_intf_pins packet_generator_1/AXIS_TX] [get_bd_intf_pins ethernet/ETH1_TX_STREAM]
connect_bd_intf_net [get_bd_intf_ports pci_refclk] [get_bd_intf_pins pcie_axi_bridge/pci_refclk]
connect_bd_intf_net [get_bd_intf_pins pcie_axi_bridge/M_AXI_B] [get_bd_intf_pins system_interconnect/S00_AXI]
connect_bd_intf_net [get_bd_intf_ports pcie_mgt] [get_bd_intf_pins pcie_axi_bridge/pcie_mgt]
connect_bd_intf_net [get_bd_intf_ports qsfp0_gt] [get_bd_intf_pins ethernet/qsfp0_gt]
connect_bd_intf_net [get_bd_intf_ports qsfp1_gt] [get_bd_intf_pins ethernet/qsfp1_gt]
connect_bd_intf_net [get_bd_intf_pins system_interconnect/M00_AXI] [get_bd_intf_pins pcie_axi_bridge/S_BRIDGE_CTRL_AXI]
connect_bd_intf_net [get_bd_intf_pins system_interconnect/M01_AXI] [get_bd_intf_pins ethernet/AXI_ETH_STATUS]
connect_bd_intf_net [get_bd_intf_pins axi_revision/S_AXI] [get_bd_intf_pins system_interconnect/M02_AXI]
connect_bd_intf_net [get_bd_intf_pins system_interconnect/M03_AXI] [get_bd_intf_pins packet_generator_0/S_AXI]
connect_bd_intf_net [get_bd_intf_pins system_interconnect/M04_AXI] [get_bd_intf_pins pcie_axi_bridge/S_AXI_B]
connect_bd_intf_net [get_bd_intf_pins system_interconnect/M05_AXI] [get_bd_intf_pins packet_generator_1/S_AXI]
connect_bd_intf_net [get_bd_intf_pins system_interconnect/M06_AXI] [get_bd_intf_pins ethernet/ch0_axi_ctrl]
connect_bd_intf_net [get_bd_intf_pins system_interconnect/M07_AXI] [get_bd_intf_pins ethernet/ch1_axi_ctrl]
connect_bd_net -net eth0_channel_up [get_bd_pins ethernet/eth0_channel_up] [get_bd_ports eth0_up]
connect_bd_net -net eth1_channel_up [get_bd_pins ethernet/eth1_channel_up] [get_bd_ports eth1_up]
connect_bd_net [get_bd_pins ethernet/eth_rx_clk_out] [get_bd_pins data_sink_1/clk] [get_bd_pins data_sink_0/clk]
connect_bd_net [get_bd_pins ethernet/eth_rx_resetn_out] [get_bd_pins data_sink_1/resetn] [get_bd_pins data_sink_0/resetn]
connect_bd_net -net ila_250mhz [get_bd_pins pcie_axi_bridge/axi_aclk] \
  [get_bd_pins system_interconnect/aclk] [get_bd_pins ethernet/eth_tx_clk_in] [get_bd_pins axi_revision/AXI_ACLK] \
  [get_bd_pins packet_generator_0/clk] [get_bd_pins packet_generator_1/clk]
connect_bd_net [get_bd_ports pb_rst_n] [get_bd_pins source_100mhz/pb_rst_n]
connect_bd_net [get_bd_pins pcie_axi_bridge/led_pci_link_up] [get_bd_ports led_pci_link_up]
connect_bd_net -net reset_100mhz_1 [get_bd_pins source_100mhz/peripheral_reset] [get_bd_pins ethernet/reset_100mhz]
connect_bd_net -net sys_rst_n_1 [get_bd_pins source_100mhz/peripheral_aresetn] [get_bd_pins pcie_axi_bridge/sys_rst_n]
connect_bd_net -net util_ds_buf_0_IBUF_OUT [get_bd_pins source_100mhz/clk_100mhz_out] [get_bd_pins ethernet/init_clk]
connect_bd_net -net xdma_0_axi_aresetn [get_bd_pins pcie_axi_bridge/axi_aresetn] \
  [get_bd_pins ethernet/resetn_250mhz] [get_bd_pins axi_revision/AXI_ARESETN] [get_bd_pins packet_generator_0/resetn] \
  [get_bd_pins packet_generator_1/resetn]

# ---- address map ----
assign_bd_address -offset 0x0000000000000000 -range 16E -target_address_space [get_bd_addr_spaces packet_generator_0/axis_aximm_shim/M_AXI] [get_bd_addr_segs packet_generator_0/rdma_xmit/S_AXI/reg0]
assign_bd_address -offset 0x0000000000000000 -range 16E -target_address_space [get_bd_addr_spaces packet_generator_1/axis_aximm_shim/M_AXI] [get_bd_addr_segs packet_generator_1/rdma_xmit/S_AXI/reg0]
assign_bd_address -offset 0x0000000000000000 -range 256 -target_address_space [get_bd_addr_spaces pcie_axi_bridge/pcie_bridge/M_AXI_B] [get_bd_addr_segs axi_revision/S_AXI/reg0]
assign_bd_address -offset 0x0000000000000500 -range 256 -target_address_space [get_bd_addr_spaces pcie_axi_bridge/pcie_bridge/M_AXI_B] [get_bd_addr_segs ethernet/axi_eth_status/S_AXI/reg0]
assign_bd_address -offset 0x0000000000001000 -range 256 -target_address_space [get_bd_addr_spaces pcie_axi_bridge/pcie_bridge/M_AXI_B] [get_bd_addr_segs packet_generator_0/packet_generator/S_AXI/reg0]
assign_bd_address -offset 0x0000000000002000 -range 256 -target_address_space [get_bd_addr_spaces pcie_axi_bridge/pcie_bridge/M_AXI_B] [get_bd_addr_segs packet_generator_1/packet_generator/S_AXI/reg0]
assign_bd_address -offset 0x000000000000F000 -range 256 -target_address_space [get_bd_addr_spaces pcie_axi_bridge/pcie_bridge/M_AXI_B] [get_bd_addr_segs pcie_axi_bridge/pcie_bridge/S_AXI_LITE/CTL0]
assign_bd_address -offset 0x0000000000010000 -range 64K -target_address_space [get_bd_addr_spaces pcie_axi_bridge/pcie_bridge/M_AXI_B] [get_bd_addr_segs ethernet/ch0_ethernet/eth_core/s_axi/Reg]
assign_bd_address -offset 0x0000000000020000 -range 64K -target_address_space [get_bd_addr_spaces pcie_axi_bridge/pcie_bridge/M_AXI_B] [get_bd_addr_segs ethernet/ch1_ethernet/eth_core/s_axi/Reg]
assign_bd_address -offset 0x0000000076000000 -range 1M -target_address_space [get_bd_addr_spaces pcie_axi_bridge/pcie_bridge/M_AXI_B] [get_bd_addr_segs pcie_axi_bridge/pcie_bridge/S_AXI_B/BAR0]

validate_bd_design
save_bd_design
